# EAGLE design HC-SR04_Sensor (EAGLE 5.12)
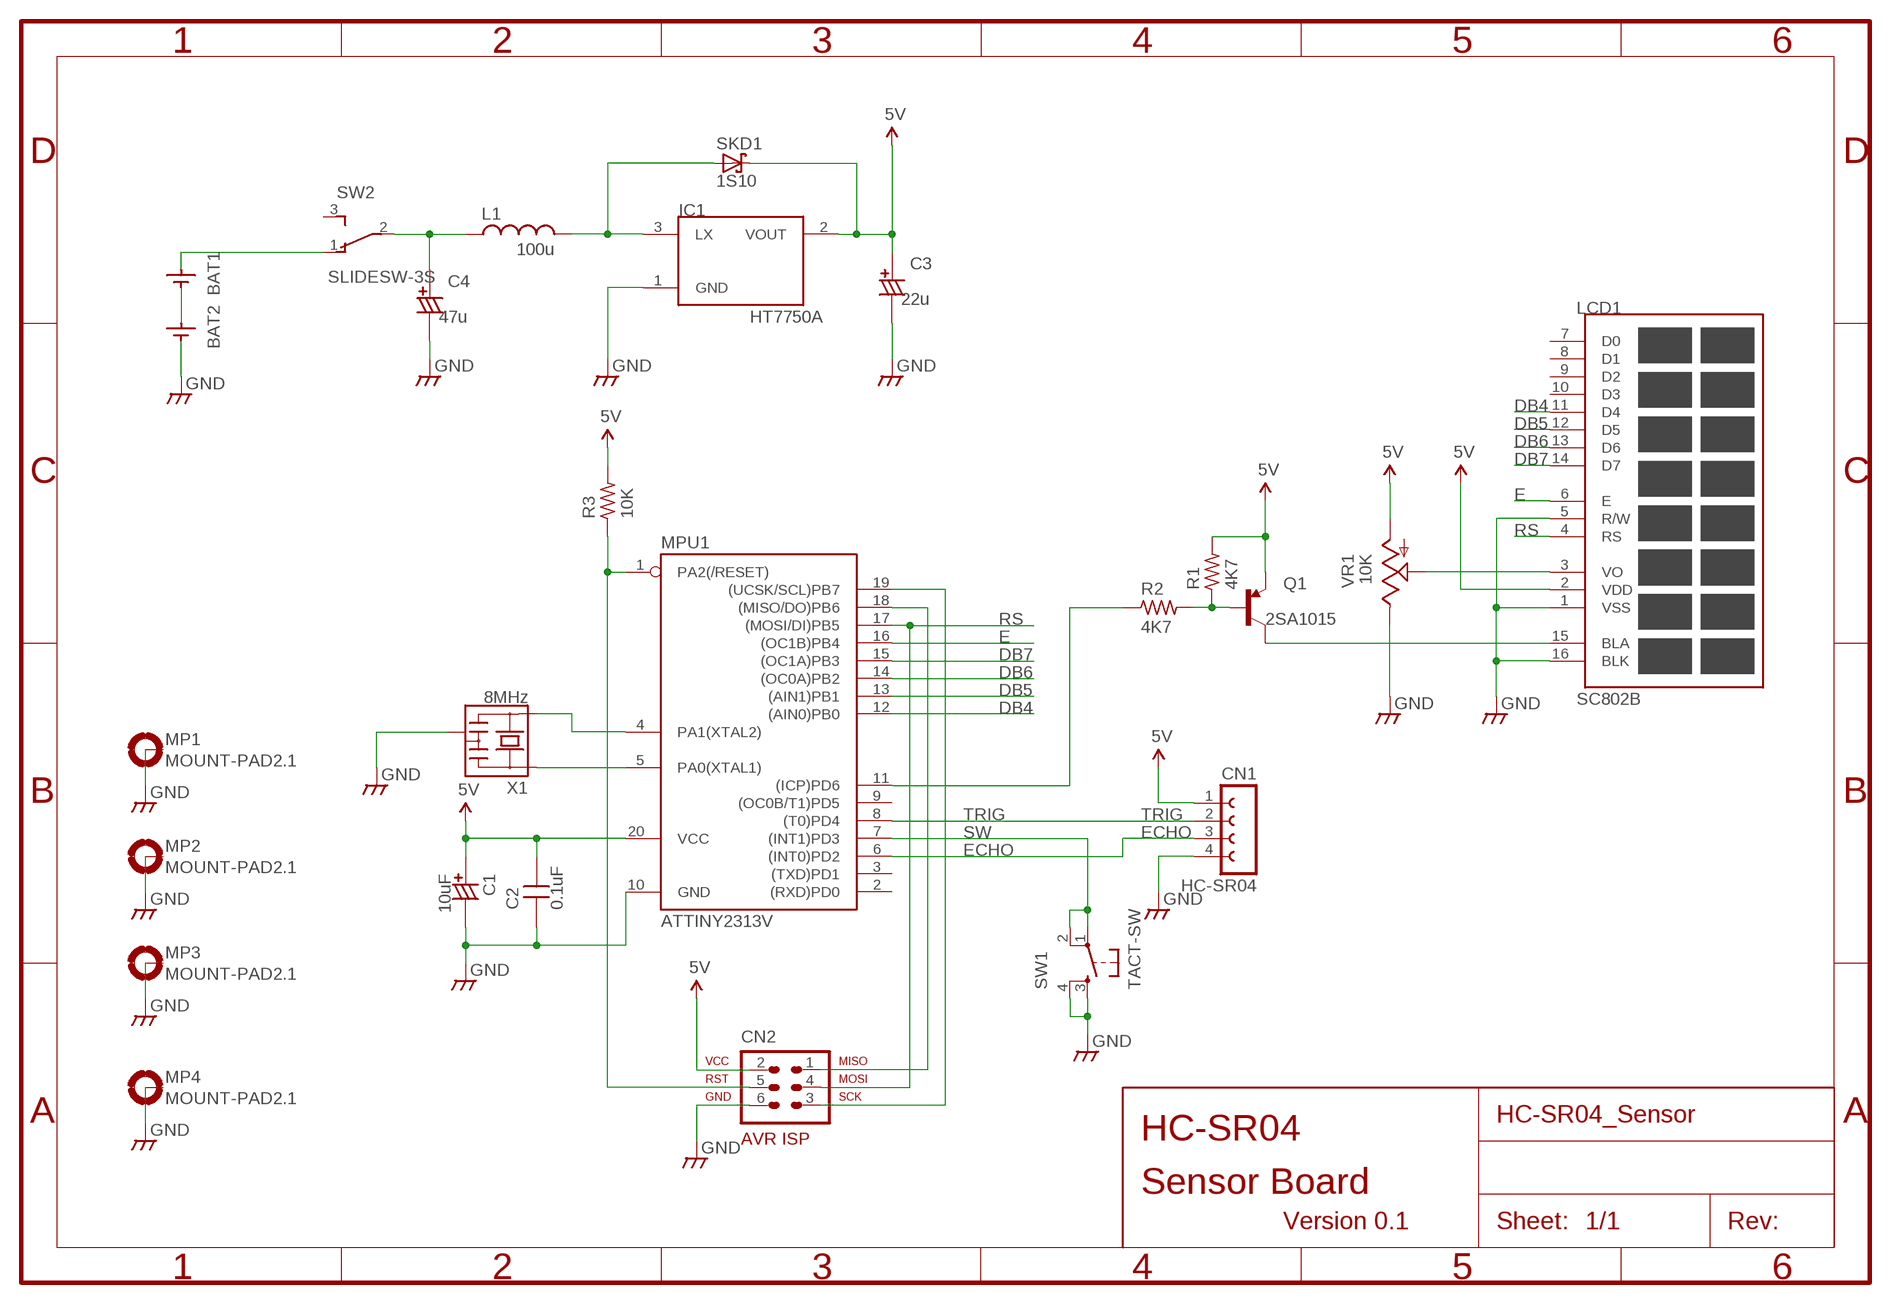
[diagram p0: schematic, sheet 1]

## Parts
BAT1  BH311P  [BH311P]
BAT2  BH311P  [BH311P]
C1  10uF  CCAP6.5  [CCAP_6.5]
C2  0.1uF  CAPDIP_2  [CAP_DIP_2]
C3  22u  CCAP6.5  [CCAP_6.5]
C4  47u  CCAP6.5  [CCAP_6.5]
CN2  AVR-ISP-6NS  [2X3-NS]
HC-SR04  CN1  CON-S4-1  [CON-S4-1]
IC1  HT7750A  HT7750A'2'  [TO92_TRI_2]
L1  100u  L-US6000-XXX-RC  [6000-XXXX-RC]
LCD1  SC802B  [SC802B]
MP1  MOUNT-PAD2.1  [PAD-2.1]
MP2  MOUNT-PAD2.1  [PAD-2.1]
MP3  MOUNT-PAD2.1  [PAD-2.1]
MP4  MOUNT-PAD2.1  [PAD-2.1]
MPU1  ATTINY2313V  TINY2313-*P*  [DIL20]
Q1  2SA1015  [TO92]
R1  4K7  R0.125W_3P  [R_0.125W_3]
R2  4K7  R0.125W_3P  [R_0.125W_3]
R3  10K  R0.125W_3P  [R_0.125W_3]
SKD1  1S10  [R-1]
SW1  TACT-SW  [B3F-10X]
SW2  SLIDESW-3S  [DS-3]
VR1  10K  POTMIDDLE  [POT_MIDDLE]
X1  8MHz  CERALOCK  [CSTLS]

## Nets
5V: C1.+ C2.2 C3.+ CN2.2 HC-SR04.1 IC1.2(VOUT) LCD1.2(VDD) MPU1.20(VCC) Q1.E R1.2 R3.2 SKD1.2-K(K) VR1.A
DB4: LCD1.11(D4) MPU1.12((AIN0)PB0)
DB5: LCD1.12(D5) MPU1.13((AIN1)PB1)
DB6: LCD1.13(D6) MPU1.14((OC0A)PB2)
DB7: LCD1.14(D7) MPU1.15((OC1A)PB3)
E: LCD1.6(E) MPU1.16((OC1B)PB4)
ECHO: HC-SR04.3 MPU1.6((INT0)PD2)
GND: BAT2.BATT-MINUS(MINUS) C1.- C2.1 C3.- C4.- CN2.6 HC-SR04.4 IC1.1(GND) LCD1.1(VSS) LCD1.5(R/W) LCD1.16(BLK) MP1.B2,1(MOUNT) MP2.B2,1(MOUNT) MP3.B2,1(MOUNT) MP4.B2,1(MOUNT) MPU1.10(GND) SW1.3(S) SW1.4(S1) VR1.E X1.2
N$1: LCD1.3(VO) VR1.S
N$2: Q1.B R1.1 R2.2
N$3: MPU1.11((ICP)PD6) R2.1
N$4: BAT1.BATT-MINUS(MINUS) BAT2.BATT-PLUS(PLUS)
N$5: BAT1.BATT-PLUS(PLUS) SW2.1(O)
N$6: LCD1.15(BLA) Q1.C
N$7: C4.+ L1.1 SW2.2(P)
N$8: CN2.5 MPU1.1(PA2(/RESET)) R3.1
N$11: IC1.3(LX) L1.2 SKD1.1-A(A)
N$15: CN2.1 MPU1.18((MISO/DO)PB6)
N$17: MPU1.4(PA1(XTAL2)) X1.3
N$18: MPU1.5(PA0(XTAL1)) X1.1
N$24: CN2.3 MPU1.19((UCSK/SCL)PB7)
RS: CN2.4 LCD1.4(RS) MPU1.17((MOSI/DI)PB5)
SW: MPU1.7((INT1)PD3) SW1.1(P) SW1.2(P1)
TRIG: HC-SR04.2 MPU1.8((T0)PD4)
Unconnected: LCD1.7(D0) LCD1.8(D1) LCD1.9(D2) LCD1.10(D3) MPU1.2((RXD)PD0) MPU1.3((TXD)PD1) MPU1.9((OC0B/T1)PD5) SW2.3(S)

## Notes on the sheet
- HC-SR04
- Sensor Board
- Version 0.1

## Library data of the parts
BAT1 BAT2 = densikit:BH311P
C1 C3 C4 = MyLib:CCAP: Polar capacitor
C2 = MyLib:CAP: Non polar capacitor
CN2 = atmel:AVR-ISP-6: AVR ISP-6 Serial Programming Header
HC-SR04 = bant:CON-S4-1
IC1 = keinSoft-01:HT7750A: PFM Step-up DC/DC Converter HT7750A Input: 0.7V ~ , Output: 5.0V
L1 = rcl:L-US: INDUCTOR, American symbol
LCD1 = bant2:SC802B
MP1-MP4 = MyLib:MOUNT-PAD: 2.1mm Mount Pad (Connectable to GND)
MPU1 = atmel:TINY2313*: Atmel Tiny2313 2K Flash, 128 bytes EEPROM, 128 bytes RAM
Q1 = bant2:2SA1015: General PNP Transistor
R1-R3 = MyLib:R: General Resiter 1/8W 1/4W 1/2W V/H
SKD1 = keinSoft-01:1S10: Shotkey barrier diode 1S10 100V, 1A
SW1 = MyLib:TACT-SW: Tacticle Push Switch
SW2 = MyLib:SLIDESW-3: 3P Slide Switch
VR1 = MyLib:POT: Volume Trimmer Resister
X1 = MyLib:CERALOCK: Ceralock Oscillator

## Board
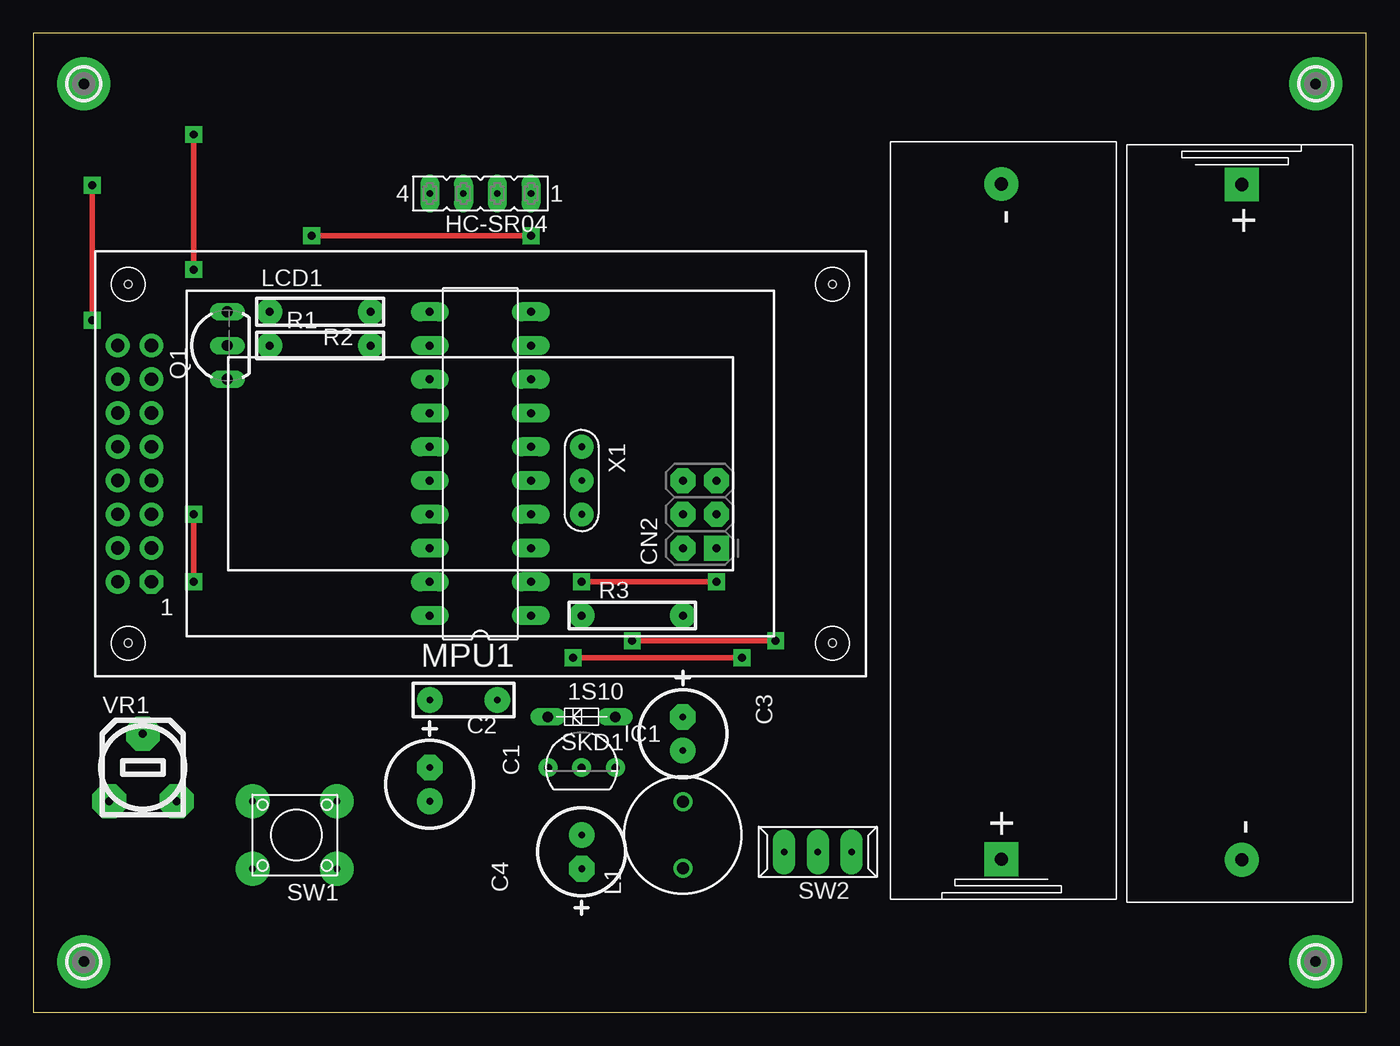
[diagram p1: board, top side]
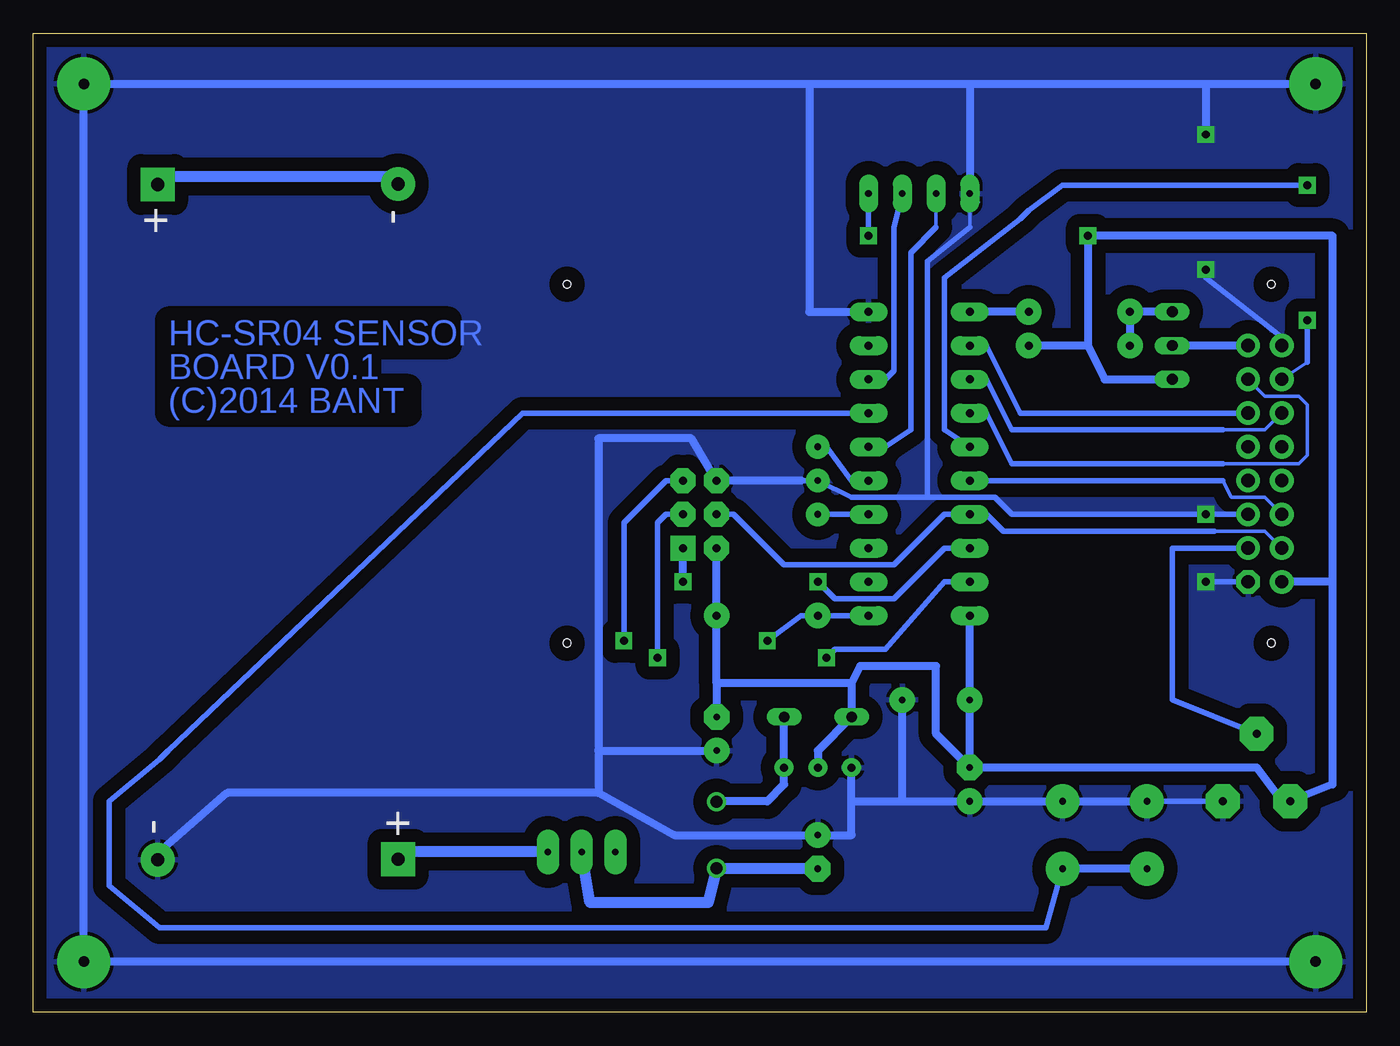
[diagram p2: board, bottom side, seen from below]

Size 100.33 x 73.66 mm. Coordinates in mm from the lower left corner, seen from the top.
Outline: 0,0 100.33,0 100.33,73.66 0,73.66 0,0
Copper layers (1*16): Top 0.035mm / dielectric 1.5mm / Bottom 0.035mm
Design rules "default": minimum track width 10mil, minimum drill 24mil, track to track 8mil, track to pad 8mil, pad to pad 8mil, via to via 8mil, smd to smd 8mil, copper to edge 40mil, drill to drill 8mil, minimum pad ring 10mil, minimum via ring 8mil, stop-mask expansion 4mil, vias tented up to drill 0mil, thermal gap 10mil

### Footprints (pad centres in the part's own frame; a part is rotated, then mirrored left to right if it is on the bottom)
BH311P = drill 1 pad 2.54 round: BATT-MINUS 25.86,0.15 | drill 1 pad 2.54 square: BATT-PLUS -24.94,0.15
CCAP_6.5 = drill 0.5 pad 1.93 octagon: + -1.27,0 | drill 0.5 pad 1.93 round: - 1.27,0
CAP_DIP_2 = drill 0.5 pad 1.93 round: 1 -2.54,0; 2 2.54,0
2X3-NS = drill 0.6 pad 1.88 square: 1 -2.54,-1.27 | drill 0.6 pad 1.88 octagon: 2 -2.54,1.27; 3 0,-1.27; 4 0,1.27; 5 2.54,-1.27; 6 2.54,1.27
CON-S4-1 = drill 0.5 pad 1.422 long: 1 -3.81,0; 2 -1.27,0; 3 1.27,0; 4 3.81,0
TO92_TRI_2 = drill 0.6 pad 1.422 round: 1 -2.54,0; 2 0,0; 3 2.54,0
6000-XXXX-RC = drill 0.9 pad 1.422 round: 1 -2.5,0; 2 2.5,0
SC802B = drill 1 pad 1.778 octagon: 1 -24.76,-8.89 | drill 1 pad 1.778 round: 2 -27.3,-8.89; 3 -24.76,-6.35; 4 -27.3,-6.35; 5 -24.76,-3.81; 6 -27.3,-3.81; 7 -24.76,-1.27; 8 -27.3,-1.27; 9 -24.76,1.27; 10 -27.3,1.27; 11 -24.76,3.81; 12 -27.3,3.81; 13 -24.76,6.35; 14 -27.3,6.35; 15 -24.76,8.89; 16 -27.3,8.89 | hole 0.6: -26.5,13.5; -26.5,-13.5; 26.5,-13.5; 26.5,13.5
PAD-2.1 = drill 0.8 pad 4 round: B2,1 0,0
DIL20 = drill 0.6 pad 1.422 long: 1 -11.43,-3.81; 2 -8.89,-3.81; 3 -6.35,-3.81; 4 -3.81,-3.81; 5 -1.27,-3.81; 6 1.27,-3.81; 7 3.81,-3.81; 8 6.35,-3.81; 9 8.89,-3.81; 10 11.43,-3.81; 11 11.43,3.81; 12 8.89,3.81; 13 6.35,3.81; 14 3.81,3.81; 15 1.27,3.81; 16 -1.27,3.81; 17 -3.81,3.81; 18 -6.35,3.81; 19 -8.89,3.81; 20 -11.43,3.81
TO92 = drill 0.813 long: B 2.54,0; C 0,0; E -2.54,0
R_0.125W_3 = drill 0.6 pad 1.93 round: 1 -3.81,0; 2 3.81,0
R-1 = drill 0.8 long: 1-A -2.54,0; 2-K 2.54,0
B3F-10X = drill 0.5 pad 2.54 round: 1 -1.27,2.54; 2 5.08,2.54; 3 -1.27,-2.54; 4 5.08,-2.54
DS-3 = drill 0.5 pad 1.676 long: 1 0,-2.54; 2 0,0; 3 0,2.54
POT_MIDDLE = drill 0.6 pad 2.54 octagon: A -2.54,-2.54; E 2.54,-2.54; S 0,2.54
CSTLS = drill 0.5 pad 1.778 round: 1 -2.54,0; 2 0,0; 3 2.54,0

### Placement (x,y rotation side)
BAT1  73.03,36.45 90 top
BAT2  90.81,37.34 270 top
C1  29.84,17.14 270 top
C2  32.38,23.5 180 top
C3  48.9,20.95 270 top
C4  41.27,12.06 90 top
CN2  50.16,37.47 90 top
HC-SR04  33.66,61.59 180 top
IC1  41.27,18.41 0 top
L1  48.9,13.34 90 top
LCD1  33.66,41.27 0 top
MP1  3.81,3.81 0 top
MP2  3.81,69.85 0 top
MP3  96.52,3.81 0 top
MP4  96.52,69.85 0 top
MPU1  33.66,41.27 90 top
Q1  14.61,50.16 90 top
R1  21.59,50.16 0 top
R2  21.59,52.7 180 top
R3  45.09,29.84 0 top
SKD1  41.27,22.23 180 top
SW1  21.59,13.34 180 top
SW2  59.05,12.06 90 top
VR1  8.26,18.41 0 top
X1  41.27,40.01 270 top

### Tracks (layer width: path | path; a pad name or v marks a point on that pad's centre or on a via)
5V  (via drill 0.6 pad 1.27)
  Top 0.406: v20.95,58.42 v37.47,58.42
  Bottom 0.254: 5.71,32.38 LCD1.2 6.99,32.38
  Bottom 0.406: v37.47,58.42 HC-SR04.1
  Bottom 0.61: IC1.2 41.27,19.68 SKD1.2-K 38.73,24.77 | Q1.E 19.68,47.62 20.95,50.16 | 20.95,50.16 v20.95,58.42 2.54,58.42 2.54,32.38 | CN2.2 R3.2 48.9,24.77 | MPU1.20 C2.2 C1.+ | C1.+ 32.38,20.95 32.38,26.04 38.1,26.04 38.73,24.77 | 38.73,24.77 48.9,24.77 | 48.9,24.77 C3.+ | 20.95,50.16 R1.2 | 2.54,32.38 2.54,17.14 VR1.A 6.35,15.88 8.26,18.41 C1.+ | 2.54,32.38 5.71,32.38
DB4
  Bottom 0.406: LCD1.11 26.04,45.09 28.57,50.16 MPU1.12
DB5
  Bottom 0.254: 10.79,43.81 7.62,43.81 LCD1.12
  Bottom 0.406: MPU1.13 28.57,47.62 26.67,43.81 10.79,43.81
DB6
  Bottom 0.254: 10.79,41.27 5.08,41.27 4.45,41.91 4.45,45.72 5.08,46.35 7.62,46.35 LCD1.13
  Bottom 0.406: MPU1.14 28.57,45.09 26.67,41.27 10.79,41.27
DB7  (via drill 0.6 pad 1.27)
  Top 0.406: v4.45,52.07 v4.45,62.23
  Bottom 0.254: LCD1.14 4.45,48.9
  Bottom 0.406: v4.45,62.23 22.86,62.23 25.4,60.33 26.04,59.69 31.75,55.24 31.75,43.81 MPU1.15 | 4.45,48.9 v4.45,52.07 | LCD1.14
E
  Bottom 0.254: 10.79,40.01 10.16,38.73 7.62,38.73 LCD1.6
  Bottom 0.406: 10.79,40.01 MPU1.16
ECHO
  Bottom 0.254: 32.38,59.05 HC-SR04.3
  Bottom 0.406: MPU1.6 36.2,42.55 34.29,43.81 34.29,57.15 32.38,59.05
GND  (via drill 0.6 pad 1.27)
  Top 0.406: v12.06,37.47 v12.06,32.38 | v12.06,66.04 v12.06,55.88
  Bottom 0.254: 90.81,12.06 BAT2.BATT-MINUS | 29.84,59.05 HC-SR04.4 29.21,60.96
  Bottom 0.406: 29.84,59.05 33.02,56.52 33.02,38.73 | 33.02,38.73 27.94,38.73 26.67,37.47 v12.06,37.47 LCD1.5 | 33.02,38.73 38.73,38.73 X1.2 42.55,40.01 | v12.06,32.38 LCD1.1 | SW1.4 VR1.E | LCD1.16 6.35,50.8 12.06,55.24 v12.06,55.88
  Bottom 0.61: 57.78,19.68 C3.- | 57.78,16.51 52.07,13.34 C4.- 38.73,13.34 38.73,15.88 | 90.81,12.06 85.72,16.51 57.78,16.51 | 57.78,19.68 57.78,43.18 50.8,43.18 CN2.6 42.55,40.01 | SW1.4 SW1.3 C1.- 34.92,15.88 | 38.73,15.88 IC1.1 | 57.78,19.68 57.78,16.51 | 38.73,15.88 34.92,15.88 | 34.92,15.88 C2.1 | MP1.B2,1 MP3.B2,1 MP4.B2,1 41.91,69.85 | 41.91,69.85 29.84,69.85 | 29.84,69.85 12.06,69.85 | 12.06,69.85 MP2.B2,1 | 29.84,69.85 HC-SR04.4 | MPU1.10 41.91,52.7 41.91,69.85 | 12.06,69.85 v12.06,66.04
  pour Bottom (isolate 1.016): 0,73.66 0,0 100.33,0 100.33,73.66
N$1
  Bottom 0.406: VR1.S 14.61,23.5 14.61,34.92 LCD1.3
N$2
  Bottom 0.61: Q1.B R2.2 R1.1
N$3
  Bottom 0.61: R2.1 MPU1.11
N$4
  Bottom 0.813: BAT2.BATT-PLUS 90.81,62.87 73.03,62.87 BAT1.BATT-MINUS
N$5
  Bottom 0.813: SW2.1 72.88,12.06 BAT1.BATT-PLUS
N$6
  Bottom 0.61: LCD1.15 Q1.C
N$7
  Bottom 0.406: 48.9,10.79 L1.1
  Bottom 0.813: C4.+ 48.9,10.79 49.53,8.26 58.42,8.26 SW2.2
N$8  (via drill 0.6 pad 1.27)
  Top 0.406: v45.09,27.94 v55.88,27.94
  Bottom 0.406: MPU1.1 R3.1 42.55,29.84 v45.09,27.94 | CN2.5 52.7,40.01 55.88,36.83 v55.88,27.94
N$11
  Bottom 0.61: SKD1.1-A IC1.3 43.81,17.14 45.09,15.88 48.9,15.88 L1.2
N$15  (via drill 0.6 pad 1.27)
  Top 0.406: v41.27,32.38 v51.44,32.38
  Bottom 0.406: MPU1.18 31.75,34.92 35.56,31.11 40.01,31.11 v41.27,32.38
  Bottom 0.61: v51.44,32.38 CN2.1
N$17
  Bottom 0.406: MPU1.4 X1.3
N$18
  Bottom 0.406: MPU1.5 38.73,40.01 40.64,42.55 X1.1
N$24  (via drill 0.6 pad 1.27)
  Top 0.406: v40.64,26.67 v53.34,26.67
  Bottom 0.406: CN2.3 52.7,37.47 53.34,36.83 v53.34,26.67 | v40.64,26.67 40.01,27.3 36.2,27.3 31.75,32.38 MPU1.19
RS
  Bottom 0.254: LCD1.4 7.62,36.2 11.43,36.2
  Bottom 0.406: CN2.4 47.62,37.47 43.81,33.66 35.56,33.66 31.75,37.47 MPU1.17 28.57,37.47 27.3,36.2 11.43,36.2 | LCD1.4
SW
  Bottom 0.406: MPU1.7 63.5,45.09 90.17,19.68 90.81,19.05 94.61,15.88 94.61,9.53 90.81,6.35 24.13,6.35 SW1.1
  Bottom 0.61: SW1.2 SW1.1
TRIG
  Bottom 0.406: MPU1.8 36.2,47.62 35.56,48.26 35.56,59.05 HC-SR04.2

### Text on the board
Bottom: HC-SR04 SENSOR | BOARD V0.1 | (C)2014 BANT